# Altium schematic sheet PWR_P12V0.SchDoc: Power +12 V
size 297 x 209 mm; Author: G.Kasprowicz; DrawnBy: G.Kasprowicz; Organization: Altium Limited; Address1: L3, 12a Rodborough Rd; Address2: Frenchs Forest; Address3: NSW; Address4: Australia 2086; DocumentNumber: 25; SheetNumber: 25; SheetTotal: 37
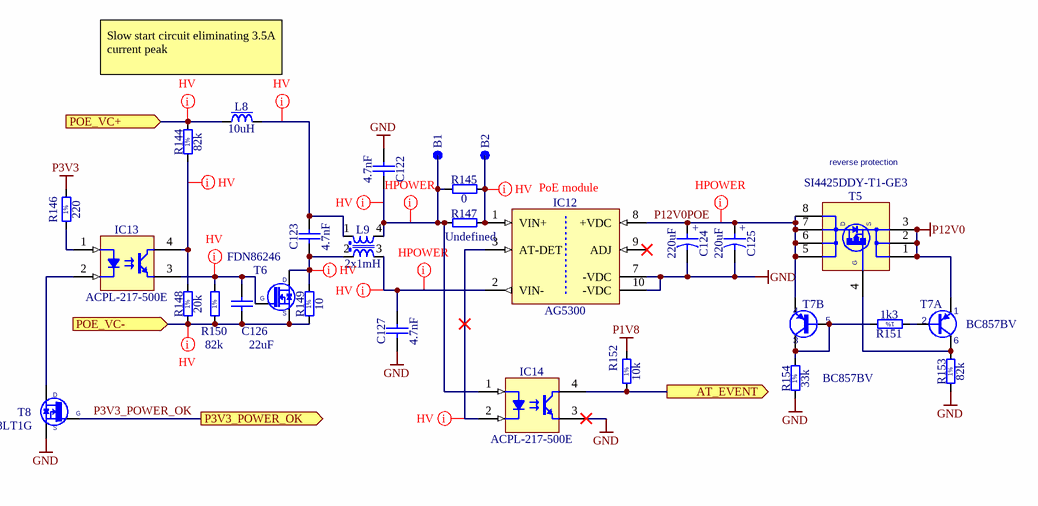
[diagram p0: PWR_P12V0.SchDoc]

## Parts
B1  SMD Pad  [C100]  (value not drawn)  (no BOM)
B2  SMD Pad  [C100]  (value not drawn)  (no BOM)
C122  4.7nF  [CAPC3216X140N]
C123  4.7nF  [CAPC3216X140N]
C124  220uF  [CAPAE830X620N]
C125  220uF  [CAPAE830X620N]
C126  22uF  [CAPC2012X135N]
C127  4.7nF  [CAPC3216X140N]
IC12  AG5300  [SILVERTEL_AG5300]
IC13  ACPL-217-500E  [SOIC127P700X242-4N]
IC14  ACPL-217-500E  [SOIC127P700X242-4N]
L8  10uH  [IND_MURATA-PS_8400]
L9  2x1mH  [IND_WURTH_WE-SL2]
R144  82k  [RESC1608X55N]
R145  0  [RESC1005X40N]
R146  220  [RESC1608X55N]
R147  Undefined  [RESC2012X60N]
R148  20k  [RESC1005X40N]
R149  10  [RESC1005X40N]
R150  82k  [RESC1608X55N]
R151  1k3  [RESC1608X55N]
R152  10k  [RESC1005X40N]
R153  82k  [RESC1608X55N]
R154  33k  [RESC1005X40N]
T5  SI4425DDY-T1-GE3  [SOIC127P600X175-8N]
T6  FDN86246  [SOT95P237X112-3N]
T7  BC857BV  [SOTFL50P160X60-6N]  (parts A,B of 2)
T8  BSS138LT1G  [SOT95P240X110-3N]

## Ports
AT_EVENT (out), P3V3_POWER_OK (out), POE_VC+ (in), POE_VC- (in)

## Nets
GND: C122.1 C124.2 C125.2 C127.1 IC12.7(-VDC) IC12.10(-VDC) IC14.3(E) R153.1 R154.1 T8.2(S)
P1V8: R152.2
P3V3: R146.2
P12V0: T5.1(S) T5.2(S) T5.3(S) T7.1(E)
AT_EVENT: IC14.4(C) R152.1 ; port AT_EVENT
P3V3_POWER_OK: T8.1(G) ; port P3V3_POWER_OK
P12V0POE: C124.1 C125.1 IC12.8(+VDC) T5.5(D) T5.6(D) T5.7(D) T5.8(D) T7.4(E)
POE_VC+: L8.1 R144.2 ; port POE_VC+
POE_VC-: C126.1 R148.1 R149.1 R150.1 T6.2(S) ; port POE_VC-
NetB1_1: B1.1 C122.2 IC14.1(A) L9.4 R145.1 R147.1
NetB2_1: B2.1 IC12.1(VIN+) R145.2 R147.2
NetC123_1: C123.1 L9.2 R149.2 T6.3(D)
NetC123_2: C123.2 L8.2 L9.1
NetC126_2: C126.2 IC13.3(E) R150.2 T6.1(G)
NetC127_2: C127.2 IC12.2(VIN-) L9.3
NetIC12_3: IC12.3(AT-DET) IC14.2(C)
NetIC13_1: IC13.1(A) R146.1
NetIC13_2: IC13.2(C) T8.3(D)
NetIC13_4: IC13.4(C) R144.1 R148.2
NetR151_1: R151.1 T7.2(B)
NetR151_2: R151.2 R154.2 T7.3(C) T7.5(B)
NetR153_2: R153.2 T5.4(S) T7.6(C)

Not connected (* = marked no-connect by the designer): IC12 9(ADJ)*

## Layout directives
net class Hpower; rule Routing Via Style [Pref Size = 0.7mm    Pref Hole Size = 0.5mm]; rule Width Constraint [Pref Width = 20mil    Min Width = 15mil    Max Width = 50mil]: NetB1_1, NetC127_2, P12V0POE
net class HV: NetB1_1, NetB2_1, NetC123_1, NetC123_2, NetC126_2, NetC127_2, NetIC12_3, NetIC13_4, POE_VC+, POE_VC-

## Notes on the sheet
- Slow start circuit eliminating 3.5A current peak
- (near IC12) PoE module
- (near T5) reverse protection
- Project
- Document
- Designer
- Drawn by
- Check.by
- File
- Last Mod.
- Print Date
- Sheet
- Size
- A4
- of
- Rev
- (in symbol CAE830-620_220UF_16V_20%) +
- (in symbol R0402_10K_1%_0.0625W_100PPM) 1%
- (in symbol R0402_10R_1%_0.0625W_200PPM) 1%
- (in symbol R0402_20K_1%_0.0625W_100PPM) 1%
- (in symbol R0402_33K_1%_0.0625W_100PPM) 1%
- (in symbol R0603_1K3_1%_0.1W_100PPM) 1%
- (in symbol R0603_82K_1%_0.1W_100PPM) 1%
- (in symbol R0603_220R_1%_0.1W_100PPM) 1%
- (in symbol SI4425DDY-T1-GE3) G

## Library data of the parts
B1 B2 = SMD_PAD_D1MM: Through Hole Pad; Part Description: 1mm Diameter SMD Pad; Mounted: No; Part Number: SMD_PAD_D1MM; Component Type: Standard (No BOM); Pin Count: 1; Family: SMD Pad; Socket: No; SMD: No; Sense: No; Status: None; ComponentHeight: 0mm; HelpURL: Undefined; Author: CERN DEM JLC; CreateDate: 10.10.2017; LatestRevisionDate: 10.10.2017; PackageDescription: 1mm Diameter SMD Pad
C122 C123 C127 = CAP_SMD_1206_4.7n_500V: Non-polarised capacitor; Part Number: CC1206_4.7NF_500V_10%_X7R; Part Description: SMD Multilayer Chip Ceramic Capacitor; Manufacturer: GENERIC; Manufacturer1 Part Number: C1206C472KCRACTU; Voltage: 500V; TC: X7R; Tolerance: ±10%; Table: Capacitors SMD; Component Kind: Standard; Component Type: Standard; Pin Count: 2; Value: 4.7nF; Status: Preferred; Manufacturer Part Number: CC1206_4.7NF_500V_10%_X7R; Case: 1206; Mounted: Yes; Socket: No; SMD: Yes; Manufacturer1 Example: KEMET; Manufacturer1 ComponentHeight: 1.7mm; HelpURL: \\cern.ch\dfs\Applications\Altium\Datasheets\CC1206_X7R_VISHAY_VJ.pdf; Author: GK; CreateDate: 2007-12-03; LatestRevisionDate: 2007-12-03
C124 C125 = CAE830-620_220UF_16V_20%: Polarised capacitor; Part Description: Aluminum Electrolytic SMT Capacitor; Manufacturer: PANASONIC; Manufacturer Part Number: EEEFK1C221AP; Voltage: 16V; Tolerance: ±20%; Part Number: CAE830-620_220UF_16V_20%; Component Kind: Standard; Component Type: Standard; Pin Count: 2; Value: 220uF; Status: Not Recommended; Case: E; Mounted: Yes; Socket: No; SMD: Yes; Sense: No; ComponentHeight: 6.2mm; HelpURL: \\cern.ch\dfs\Applications\Altium\Datasheets\CAE_PANASONIC_FK.pdf; Author: CERN DEM JLC; CreateDate: 03.12.2007; LatestRevisionDate: 05.11.2014
C126 = CC0805_22UF_16V_10%_X5R: Non-polarised capacitor; Part Description: SMD Multilayer Chip Ceramic Capacitor; Manufacturer: GENERIC; Manufacturer1 Part Number: C2012X5R1C226KT; Voltage: 16V; TC: X5R; Tolerance: ±10%; Part Number: CC0805_22UF_16V_10%_X5R; Component Kind: Standard; Component Type: Standard; Pin Count: 2; Value: 22uF; Status: Preferred; Manufacturer Part Number: CC0805_22UF_16V_10%_X5R; Case: 0805; Mounted: Yes; Socket: No; SMD: Yes; Sense: No; Manufacturer1 Example: TDK; Manufacturer1 ComponentHeight: 1.35mm; HelpURL: \\cern.ch\dfs\Applications\Altium\Datasheets\CC0805_X5R_TDK_C.pdf; Author: CERN DEM JLC; CreateDate: 25.10.2012; LatestRevisionDate: 25.10.2012
IC12 = AG5300: Power-over-Ethernet Plus (POE+) Module; Part Description: 12V 30W Power-over-Ethernet Plus (POE+); Manufacturer: SILVERTEL; PressFit: No; Bonding: No; Part Number: AG5300; Component Kind: Standard; Component Type: Standard; Device: AG5300; PackageDescription: Power-over-Ethernet Plus (POE+) Module, Body L 57.3mm x W 18mm x H 14mm; Manufacturer Part Number: AG5300; Pin Count: 10; Mounted: Yes; Socket: No; SMD: No; Sense: No; ComponentHeight: 14mm; HelpURL: \\cern.ch\dfs\Applications\Altium\Datasheets\AG5300.pdf; Author: CERN DEM JLC; CreateDate: 20.03.2018; LatestRevisionDate: 20.03.2018
IC13 IC14 = ACPL-217-500E: Single Optocoupler; Part Description: DC Input, Half-Pitch Phototransistor Optocoupler; Manufacturer: AVAGO TECHNOLOGIES; PressFit: No; Bonding: No; Part Number: ACPL-217-500E; Component Kind: Standard; Component Type: Standard; Device: ACPL-217-500E; PackageDescription: SOIC, 1.27mm, pitch; 4 pin, 2.60mm W X 4.40mm L X 2.42mm H body, IPC Medium Density; Status: Not Recommended; Manufacturer Part Number: ACPL-217-500E; Pin Count: 4; Case: SOIC4; Mounted: Yes; Socket: No; SMD: Yes; Sense: No; ComponentHeight: 2.42mm; HelpURL: \\cern.ch\dfs\Applications\Altium\Datasheets\ACPL-217-500E.pdf; Author: CERN DEM JLC; CreateDate: 11.11.2014; LatestRevisionDate: 11.11.2014
L8 = IND_10UH_10%_MURATA-PS_8400: Inductor With Core; Part Description: Miniature Surface Mount Power Inductor (8400 Serie); Manufacturer: MURATA POWER SOLUTIONS; Manufacturer Part Number: 84103C; Power: 950mA; Resistance: 0.24R; Tolerance: ±10%; Part Number: IND_10UH_10%_MURATA-PS_8400; Component Kind: Standard; Component Type: Standard; Pin Count: 2; Value: 10uH; Status: None; Mounted: Yes; Socket: No; SMD: Yes; Sense: No; ComponentHeight: 2.9mm; HelpURL: \\cern.ch\dfs\Applications\Altium\Datasheets\IND_MURATA-PS_8400.pdf; Author: CERN DEM JLC; CreateDate: 02.07.2012; LatestRevisionDate: 02.07.2012
L9 = IND_1MH_50%_WURTH_WE-SL2-744222: Inductor Common Mode; Part Description: Common Mode SMD Line Filter (WE-SL2 Series); Manufacturer: WURTH ELEKTRONIK; Manufacturer Part Number: 744222; Power: 800mA; Resistance: 0.31R; Tolerance: ±50%; Part Number: IND_1MH_50%_WURTH_WE-SL2-744222; Component Kind: Standard; Component Type: Standard; Pin Count: 4; Value: 2x1mH; Status: None; Mounted: Yes; Socket: No; SMD: Yes; Sense: No; ComponentHeight: 5.3mm; HelpURL: \\cern.ch\dfs\Applications\Altium\Datasheets\IND_WURTH_WE-SL2_744222.pdf; Author: CERN DEM JLC; CreateDate: 04.06.2012; LatestRevisionDate: 15.10.2012
R144 R150 R153 = R0603_82K_1%_0.1W_100PPM: Resistor - 1%; Part Description: General Purpose Thick Film Chip Resistor; Manufacturer: GENERIC; Manufacturer1 Part Number: NRC06F8202TRF; Power: 0.1W; TC: ±100ppm/°C; Part Number: R0603_82K_1%_0.1W_100PPM; Component Kind: Standard; Component Type: Standard; Pin Count: 2; Value: 82k; Status: Preferred; Tolerance: ±1%; Manufacturer Part Number: R0603_82K_1%_0.1W_100PPM; Case: 0603; Mounted: Yes; Sense: No; Socket: No; SMD: Yes; Manufacturer1 Example: NIC COMPONENT; Manufacturer1 ComponentHeight: 0.55mm; HelpURL: \\cern.ch\dfs\Applications\Altium\Datasheets\R0603_NIC_NRC.pdf; Author: CERN DEM JLC; CreateDate: 03.12.2007; LatestRevisionDate: 13.03.2008
R145 = R0402_0R_JUMPER: Resistor; Part Description: 1A (0.05R Max DC Resistance) Zero Ohm Jumper; Manufacturer: GENERIC; Manufacturer1 Part Number: 232270591001L; Part Number: R0402_0R_JUMPER; Component Kind: Standard; Component Type: Standard; Pin Count: 2; Value: 0; Status: Not recommended; Manufacturer Part Number: R0402_0R_JUMPER; Case: 0402; Mounted: Yes; Sense: No; Socket: No; SMD: Yes; Manufacturer1 Example: YAGEO PHYCOMP; Manufacturer1 ComponentHeight: 0.4mm; HelpURL: \\cern.ch\dfs\Applications\Altium\Datasheets\R0402_Phycomp_RC0402.pdf; Author: CERN DEM JLC; CreateDate: 03.12.2007; LatestRevisionDate: 17.10.2012
R146 = R0603_220R_1%_0.1W_100PPM: Resistor - 1%; Part Description: General Purpose Thick Film Chip Resistor; Manufacturer: GENERIC; Manufacturer1 Part Number: NRC06F2200TRF; Power: 0.1W; TC: ±100ppm/°C; Part Number: R0603_220R_1%_0.1W_100PPM; Component Kind: Standard; Component Type: Standard; Pin Count: 2; Value: 220; Status: Preferred; Tolerance: ±1%; Manufacturer Part Number: R0603_220R_1%_0.1W_100PPM; Case: 0603; Mounted: Yes; Sense: No; Socket: No; SMD: Yes; Manufacturer1 Example: NIC COMPONENT; Manufacturer1 ComponentHeight: 0.55mm; HelpURL: \\cern.ch\dfs\Applications\Altium\Datasheets\R0603_NIC_NRC.pdf; Author: CERN DEM JLC; CreateDate: 03.12.2007; LatestRevisionDate: 13.03.2008
R147 = R0805_NO-VALUE: Resistor; Part Description: Reserved Footprint For a 0805 (2012) Chip Resistor; PressFit: No; Mounted: No; Part Number: R0805_NO-VALUE; Component Kind: Standard; Component Type: Standard; Pin Count: 2; Value: Undefined; Status: None; Manufacturer: Undefined; Manufacturer Part Number: R0805_NO-VALUE; Case: 0805; Sense: No; Socket: No; SMD: Yes; Manufacturer1 Example: Undefined; Manufacturer1 Part Number: Undefined; Manufacturer1 ComponentHeight: Undefined; HelpURL: Undefined; Author: CERN DEM JLC; CreateDate: 03.12.2007; LatestRevisionDate: 13.03.2008
R148 = R0402_20K_1%_0.0625W_100PPM: Resistor - 1%; Part Description: General Purpose Thick Film Chip Resistor; Manufacturer: GENERIC; Manufacturer1 Part Number: 232270672003L; TC: ±100ppm/°C; PressFit: No; Part Number: R0402_20K_1%_0.0625W_100PPM; Component Kind: Standard; Component Type: Standard; Pin Count: 2; Value: 20k; Status: Not Recommended; Power: 0.0625W; Tolerance: ±1%; Manufacturer Part Number: R0402_20K_1%_0.0625W_100PPM; Case: 0402; Mounted: Yes; Sense: No; Socket: No; SMD: Yes; Manufacturer1 Example: YAGEO PHYCOMP; Manufacturer1 ComponentHeight: 0.4mm; HelpURL: \\cern.ch\dfs\Applications\Altium\Datasheets\R0402_Phycomp_RC0402.pdf; Author: CERN DEM JLC; CreateDate: 03.12.2007; LatestRevisionDate: 17.10.2012
R149 = R0402_10R_1%_0.0625W_200PPM: Resistor - 1%; Part Description: General Purpose Thick Film Chip Resistor; Manufacturer: GENERIC; Manufacturer1 Part Number: 232270671009L; TC: ±200ppm/°C; PressFit: No; Part Number: R0402_10R_1%_0.0625W_200PPM; Component Kind: Standard; Component Type: Standard; Pin Count: 2; Value: 10; Status: Not Recommended; Power: 0.0625W; Tolerance: ±1%; Manufacturer Part Number: R0402_10R_1%_0.0625W_200PPM; Case: 0402; Mounted: Yes; Sense: No; Socket: No; SMD: Yes; Manufacturer1 Example: YAGEO PHYCOMP; Manufacturer1 ComponentHeight: 0.4mm; HelpURL: \\cern.ch\dfs\Applications\Altium\Datasheets\R0402_Phycomp_RC0402.pdf; Author: CERN DEM JLC; CreateDate: 24/06/2009; LatestRevisionDate: 17/10/2012
R151 = R0603_1K3_1%_0.1W_100PPM: Resistor - 1%; Part Description: General Purpose Thick Film Chip Resistor; Manufacturer: GENERIC; Manufacturer1 Part Number: NRC06F1301TRF; Power: 0.1W; TC: ±100ppm/°C; PressFit: No; Part Number: R0603_1K3_1%_0.1W_100PPM; Component Kind: Standard; Component Type: Standard; Pin Count: 2; Value: 1k3; Status: Preferred; Tolerance: ±1%; Manufacturer Part Number: R0603_1K3_1%_0.1W_100PPM; Case: 0603; Mounted: Yes; Sense: No; Socket: No; SMD: Yes; Manufacturer1 Example: NIC COMPONENT; Manufacturer1 ComponentHeight: 0.55mm; HelpURL: \\cern.ch\dfs\Applications\Altium\Datasheets\R0603_NIC_NRC.pdf; Author: CERN DEM JLC; CreateDate: 03.12.2007; LatestRevisionDate: 13.03.2008
R152 = R0402_10K_1%_0.0625W_100PPM: Resistor - 1%; Part Description: General Purpose Thick Film Chip Resistor; Manufacturer: GENERIC; Manufacturer1 Part Number: 232270671003L; TC: ±100ppm/°C; PressFit: No; Part Number: R0402_10K_1%_0.0625W_100PPM; Component Kind: Standard; Component Type: Standard; Pin Count: 2; Value: 10k; Status: Not Recommended; Power: 0.0625W; Tolerance: ±1%; Manufacturer Part Number: R0402_10K_1%_0.0625W_100PPM; Case: 0402; Mounted: Yes; Sense: No; Socket: No; SMD: Yes; Manufacturer1 Example: YAGEO PHYCOMP; Manufacturer1 ComponentHeight: 0.4mm; HelpURL: \\cern.ch\dfs\Applications\Altium\Datasheets\R0402_Phycomp_RC0402.pdf; Author: CERN DEM JLC; CreateDate: 03.12.2007; LatestRevisionDate: 17.10.2012
R154 = R0402_33K_1%_0.0625W_100PPM: Resistor - 1%; Part Description: General Purpose Thick Film Chip Resistor; Manufacturer: GENERIC; Manufacturer1 Part Number: 232270673303L; TC: ±100ppm/°C; PressFit: No; Part Number: R0402_33K_1%_0.0625W_100PPM; Component Kind: Standard; Component Type: Standard; Pin Count: 2; Value: 33k; Status: Not Recommended; Power: 0.0625W; Tolerance: ±1%; Manufacturer Part Number: R0402_33K_1%_0.0625W_100PPM; Case: 0402; Mounted: Yes; Sense: No; Socket: No; SMD: Yes; Manufacturer1 Example: YAGEO PHYCOMP; Manufacturer1 ComponentHeight: 0.4mm; HelpURL: \\cern.ch\dfs\Applications\Altium\Datasheets\R0402_Phycomp_RC0402.pdf; Author: CERN DEM JLC; CreateDate: 03.12.2007; LatestRevisionDate: 17.10.2012
T5 = SI4425DDY-T1-GE3: -30V -19.7A P-Channel MOSFET; Manufacturer: VISHAY SILICONIX; PressFit: No; Bonding: No; Part Number: SI4425DDY-T1-GE3; Component Kind: Standard; Component Type: Standard; Device: SI4425DDY-T1-GE3; PackageDescription: SOIC 8, Pitch 1.27mm - Body 4x5mm, IPC Medium Density; Part Description: -30V -19.7A P-Channel MOSFET; Manufacturer Part Number: SI4425DDY-T1-GE3; Pin Count: 8; Case: SOIC8; Mounted: Yes; Socket: No; SMD: Yes; Sense: No; ComponentHeight: 1.75mm; HelpURL: \\cern.ch\dfs\Applications\Altium\Datasheets\SI4425DDY-T1-GE3.pdf; Author: CERN DEM MR; CreateDate: 05/10/2016; LatestRevisionDate: 05/10/2016
T6 = FDN86246: N-CHANNEL MOSFET WITH DIODE; Part Description: 150V 1.6A N-Channel Power Trench® MOSFET; Manufacturer: ON SEMICONDUCTOR; PressFit: No; Bonding: No; Part Number: FDN86246; Component Kind: Standard; Component Type: Standard; Device: FDN86246; PackageDescription: SOT, 0.95mm, pitch; 3 pin,1.30mm W X 2.92mm L X 1.12mm H body, IPC Medium Density; Manufacturer Part Number: FDN86246; Pin Count: 3; Case: SOT23-3; Mounted: Yes; Socket: No; SMD: Yes; Sense: No; ComponentHeight: 1.12mm; HelpURL: \\cern.ch\dfs\Applications\Altium\Datasheets\FDN86246.pdf; ComponentLink1URL: \\cern.ch\dfs\Applications\Altium\Datasheets\FDN86246_Package.pdf; ComponentLink1Description: Package Drawing; Author: CERN DEM BC; CreateDate: 10.10.2019; LatestRevisionDate: 10.10.2019
T7 = BC857BV: 45V, 100mA PNP General Purpose Double Transistor; Part Description: -45V -100mA PNP General Purpose Double Transistor; Manufacturer: NXP SEMICONDUCTORS; PressFit: No; Bonding: No; Part Number: BC857BV; Component Kind: Standard; Component Type: Standard; Device: BC857BV; PackageDescription: SOTFL (SOT666), 0.50mm, Pitch; 6 Pin, 1.20mm W X 1.60mm L X 0.60mm H Body, IPC Medium Density; Manufacturer Part Number: BC857BV; Pin Count: 6; Case: SOT666; Mounted: Yes; Socket: No; SMD: Yes; Sense: No; ComponentHeight: 0.6mm; HelpURL: \\cern.ch\dfs\Applications\Altium\Datasheets\BC857BV.pdf; Author: CERN DEM JLC; CreateDate: 01/12/2011; LatestRevisionDate: 01/12/2011
T8 = BSS138LT1G: N-CHANNEL MOSFET WITH DIODE; Part Description: 50V 200mA N-Channel Enhancement Mode Field-Effect Transistor; Manufacturer: ON SEMICONDUCTOR; PressFit: No; Bonding: No; Part Number: BSS138LT1G; Component Kind: Standard; Component Type: Standard; Device: BSS138LT1G; PackageDescription: SOT23 3-Leads, Pitch 0.95mm - Body 1.4x3mm, IPC Medium Density; Manufacturer Part Number: BSS138LT1G; Pin Count: 3; Case: SOT23-3; Mounted: Yes; Socket: No; SMD: Yes; Sense: No; ComponentHeight: 1.11mm; HelpURL: \\cern.ch\dfs\Applications\Altium\Datasheets\BSS138LT1G.pdf; Author: CERN DEM JLC; CreateDate: 23.03.2009; LatestRevisionDate: 23.03.2009